# EAGLE design IFB-40002-R02 - I2C_Joystick (EAGLE 9.6.2)
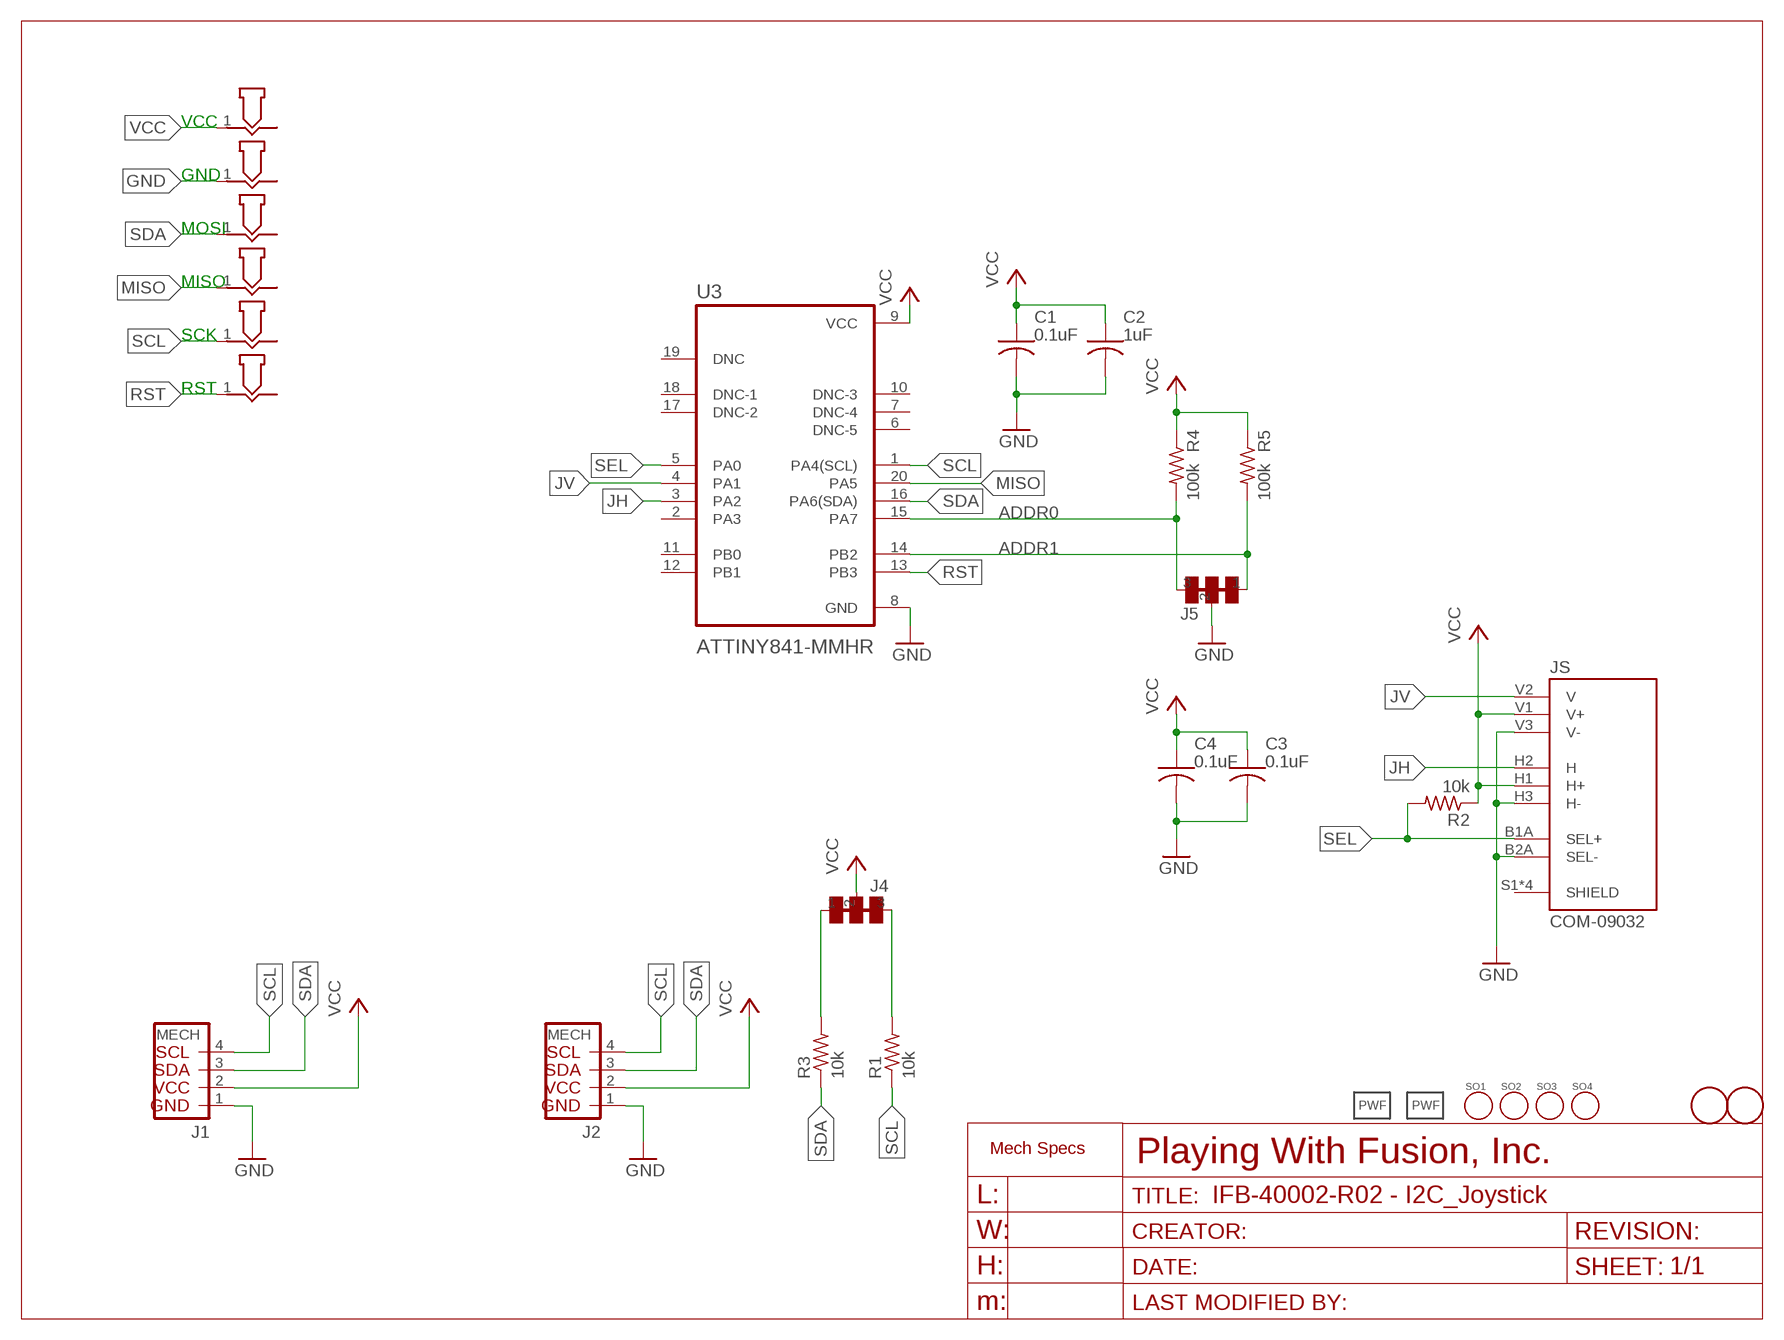
[diagram p0: schematic, sheet 1]

## Parts
C1  0.1uF  C-USC0603K  [C0603K]
C2  1uF  C-USC0603K  [C0603K]
C3  0.1uF  C-USC0603K  [C0603K]
C4  0.1uF  C-USC0603K  [C0603K]
GND  POGO_PAD  [P50_POGO_BOARD_CONTACT_12MIL]
J1  QWIICSIDE  [SM04B-SRSS-TB]
J2  QWIICSIDE  [SM04B-SRSS-TB]
J4  CUT_JUMPER_2X  [SMT_2X_CUTTABLE_JUMPER]
J5  CUT_JUMPER_2X  [SMT_2X_CUTTABLE_JUMPER]
JS  COM-09032  [XDCR_COM-09032]
LOGO1  PWF_LOGOPWF-6MM-SS  [LOGO_6MM_STEIN]
LOGO2  PWF_LOGOPWF-6MM-SS  [LOGO_6MM_STEIN]
MISO  POGO_PAD  [P50_POGO_BOARD_CONTACT_12MIL]
MOSI  POGO_PAD  [P50_POGO_BOARD_CONTACT_12MIL]
R1  10k  R-US_R0603  [R0603]
R2  10k  R-US_R0603  [R0603]
R3  10k  R-US_R0603  [R0603]
R4  100k  R-US_R0603  [R0603]
R5  100k  R-US_R0603  [R0603]
RST  POGO_PAD  [P50_POGO_BOARD_CONTACT_12MIL]
SCK  POGO_PAD  [P50_POGO_BOARD_CONTACT_12MIL]
SO1  STAND_OFFNO4_TIGHT  [STANDOFF_NO4_TIGHT]
SO2  STAND_OFFNO4_TIGHT  [STANDOFF_NO4_TIGHT]
SO3  STAND_OFFNO4_TIGHT  [STANDOFF_NO4_TIGHT]
SO4  STAND_OFFNO4_TIGHT  [STANDOFF_NO4_TIGHT]
U3  ATTINY841-MMHR  [QFN45P300X300X85-21N]
U$2  FIDUCIAL  [FIDUCIAL_1MM]
U$3  FIDUCIAL  [FIDUCIAL_1MM]
VCC  POGO_PAD  [P50_POGO_BOARD_CONTACT_12MIL]

## Nets
ADDR0: J5.3 R4.2 U3.15(PA7)
ADDR1: J5.1 R5.2 U3.14(PB2)
GND: C1.2 C2.2 C3.2 C4.2 GND.1 J1.1 J2.1 J5.2 JS.B2A(SEL-) JS.H3(H-) JS.V3(V-) U3.8(GND)
JH: JS.H2(H) U3.3(PA2)
JV: JS.V2(V) U3.4(PA1)
MISO: MISO.1 U3.20(PA5)
N$2: J4.1 R3.2
N$3: J4.3 R1.2
RST: RST.1 U3.13(PB3)
SCL: J1.4 J2.4 R1.1 SCK.1 U3.1(PA4(SCL))
SDA: J1.3 J2.3 MOSI.1 R3.1 U3.16(PA6(SDA))
SEL: JS.B1A(SEL+) R2.2 U3.5(PA0)
VCC: C1.1 C2.1 C3.1 C4.1 J1.2 J2.2 J4.2 JS.H1(H+) JS.V1(V+) R2.1 R4.1 R5.1 U3.9(VCC) VCC.1
Unconnected: J1.MECH1(MECH) J1.MECH2(MECH) J2.MECH1(MECH) J2.MECH2(MECH) JS.S1(SHIELD) JS.S2(SHIELD) JS.S3(SHIELD) JS.S4(SHIELD) U3.2(PA3) U3.6(DNC-5) U3.7(DNC-4) U3.10(DNC-3) U3.11(PB0) U3.12(PB1) U3.17(DNC-2) U3.18(DNC-1) U3.19(DNC)

## Notes on the sheet
- VCC
- GND
- MOSI
- MISO
- SCK
- RST

## Library data of the parts
C1-C4 = rcl:C-US: CAPACITOR, American symbol; SPICEPREFIX: C
GND MISO MOSI RST SCK VCC = PlayingWithFusion_Breakout-Lib:POGO_PAD
J1 J2 = PlayingWithFusion_JST:QWIIC
J4 J5 = PlayingWithFusion_Breakout-Lib:CUT_JUMPER_2X
JS = COM-09032:COM-09032: Thumb Joystick Check availability <https://pricing.snapeda.com/parts/COM-09032/SparkFun%20Electronics/view-part?ref=eda>; AVAILABILITY: In Stock; DESCRIPTION: Joystick, 2 - Axis Analog (Resistive) Output; MF: SparkFun Electronics; MP: COM-09032; PACKAGE: SparkFun Electronics; PRICE: None; PURCHASE-URL: https://pricing.snapeda.com/search/part/COM-09032/?ref=eda
LOGO1 LOGO2 = PlayingWithFusion_Logo:PWF_LOGO
R1-R5 = rcl:R-US_: RESISTOR, American symbol; SPICEPREFIX: R
SO1-SO4 = PlayingWithFusion_Breakout-Lib:STAND_OFF: Stand Off This is the mechanical footprint for a #4 phillips button head screw. Use the keepout ring to avoid running the screw head into surrounding components. SKU : PRT-00447
U3 = ATTINY841-MMHR:ATTINY841-MMHR: None Check availability <https://pricing.snapeda.com/parts/ATTINY841-MMHR/Microchip/view-part?ref=eda>; AVAILABILITY: In Stock; DESCRIPTION: AVR AVR® ATtiny Microcontroller IC 8-Bit 16MHz 8KB (8K x 8) FLASH 20-VQFN (3x3); MF: Microchip; MP: ATTINY841-MMHR; PACKAGE: DFN-20 Microchip; PRICE: None; PURCHASE-URL: https://pricing.snapeda.com/search/part/ATTINY841-MMHR/?ref=eda
U$2 U$3 = PlayingWithFusion_Breakout-Lib:FIDUCIAL: For use by pick and place machines to calibrate the vision/machine, 1mm By microbuilder.eu

## Board
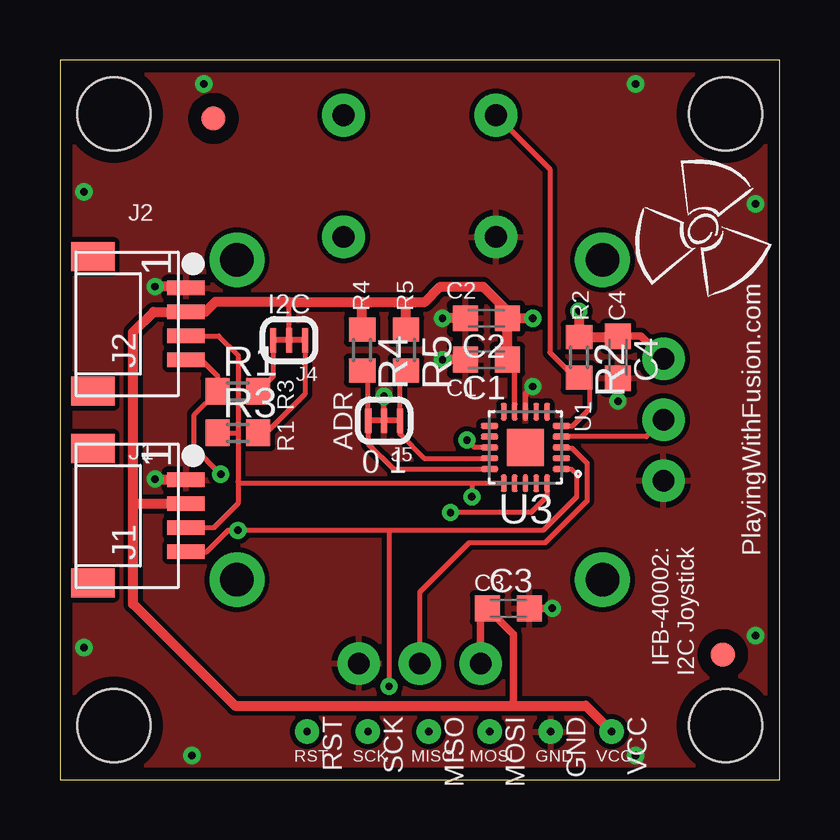
[diagram p1: board, top side]
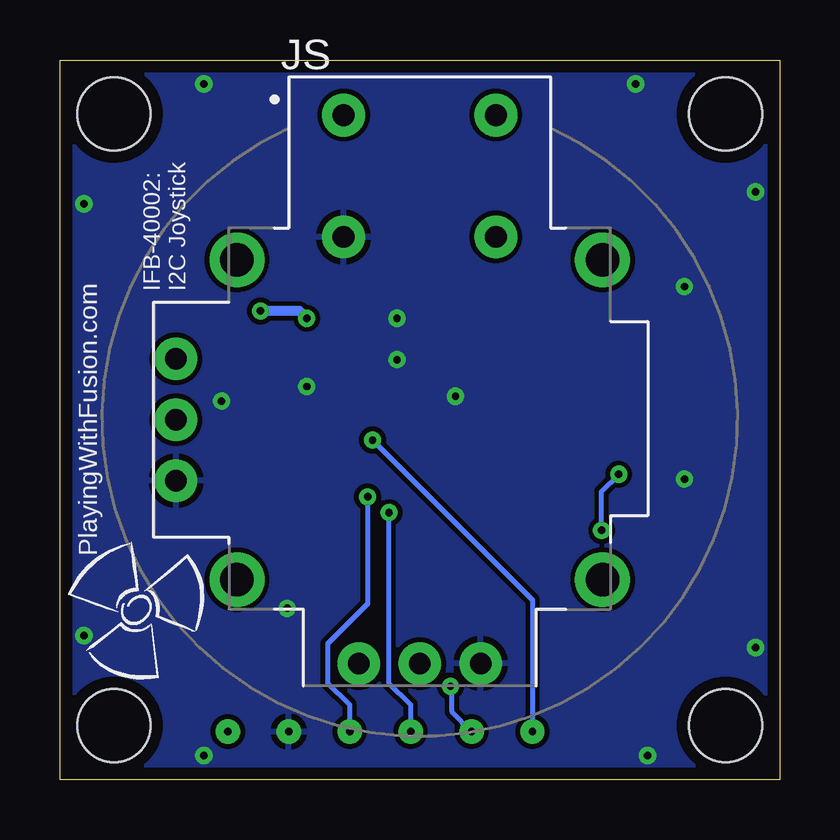
[diagram p2: board, bottom side, seen from below]

Size 30 x 30 mm. Coordinates in mm from the lower left corner, seen from the top.
Outline: 0,30 0,0 30,0 30,30 0,30
Copper layers (1*16): Top 0.035mm / dielectric 1.5mm / Bottom 0.035mm
Design rules "default *": minimum track width 8mil, minimum drill 12mil, track to track 8mil, track to pad 8mil, pad to pad 8mil, via to via 8mil, smd to smd 8mil, copper to edge 20mil, drill to drill 8mil, minimum pad ring 10mil, minimum via ring 8mil, stop-mask expansion 4mil, vias tented up to drill 17mil, thermal gap 10mil

### Footprints (pad centres in the part's own frame; a part is rotated, then mirrored left to right if it is on the bottom)
C0603K = smd 1.05 x 1.08: 1 -0.875,0; 2 0.875,0
P50_POGO_BOARD_CONTACT_12MIL = drill 0.305 pad 1.016: 1 0,0
SM04B-SRSS-TB = smd 0.6 x 1.55: 1 1.5,0; 2 0.5,0; 3 -0.5,0; 4 -1.5,0 | smd 1.2 x 1.8: MECH1 2.8,3.875; MECH2 -2.8,3.875
SMT_2X_CUTTABLE_JUMPER = smd 0.254 x 1.016: 1 -0.66,0; 2 0,0; 3 0.66,0
XDCR_COM-09032 = drill 0.9 pad 1.778: B1A -3.175,12.7; B1B 3.175,12.7; B2A -3.175,7.62; B2B 3.175,7.62 | drill 0.889 pad 1.778: H1 -2.54,-10.16; H2 0,-10.16; H3 2.54,-10.16; V1 -10.16,2.54; V2 -10.16,0; V3 -10.16,-2.54 | drill 1.397 pad 2.286: S1 -7.62,6.668; S2 -7.62,-6.668; S3 7.62,-6.668; S4 7.62,6.668
R0603 = smd 1 x 1.1: 1 -0.85,0; 2 0.85,0
STANDOFF_NO4_TIGHT = hole 3.048: 0,0
QFN45P300X300X85-21N = smd 0.72 x 0.24: 1 -1.495,0.9; 2 -1.495,0.45; 3 -1.495,0; 4 -1.495,-0.45; 5 -1.495,-0.9; 11 1.495,-0.9; 12 1.495,-0.45; 13 1.495,0; 14 1.495,0.45; 15 1.495,0.9 | smd 0.24 x 0.72: 6 -0.9,-1.495; 7 -0.45,-1.495; 8 0,-1.495; 9 0.45,-1.495; 10 0.9,-1.495; 16 0.9,1.495; 17 0.45,1.495; 18 0,1.495; 19 -0.45,1.495; 20 -0.9,1.495 | smd 1.55 x 1.55: 21 0,0
FIDUCIAL_1MM = smd 1 x 1: 1 0,0

### Placement (x,y rotation side)
C1  17.78,17.5 180 top
C2  17.78,19.23 180 top
C3  18.69,7.14 0 top
C4  23.27,17.6 270 top
GND  20.46,2 270 top
J1  5.25,11 90 top
J2  5.25,19 90 top
J4  9.55,18.32 180 top
J5  13.51,14.96 180 top
JS  15,15 0 bottom
LOGO1  26.82,22.99 270 top
LOGO2  26.82,7.04 90 bottom
MISO  15.38,2 270 top
MOSI  17.92,2 270 top
R1  7.42,16.18 0 top
R2  21.64,17.6 270 top
R3  7.42,14.46 0 top
R4  12.6,17.91 270 top
R5  14.43,17.91 270 top
RST  10.3,2 270 top
SCK  12.84,2 270 top
SO1  2.25,2.25 270 top
SO2  27.75,27.75 270 top
SO3  27.75,2.25 270 top
SO4  2.25,27.75 270 top
U3  19.41,13.85 180 top
U$2  27.64,5.21 270 top
U$3  6.4,27.56 270 top
VCC  23,2 270 top

### Tracks (layer width: path | path; a pad name or v marks a point on that pad's centre or on a via)
ADDR0
  Top 0.203: R4.2 12.85,16.81 J5.3 12.85,14 13.9,12.95 U3.15
ADDR1
  Top 0.203: R5.2 14.17,16.81 J5.1 14.17,14.4 15.18,13.4 U3.14
GND  (via drill 0.3)
  Top 0.203: J5.2 v13.51,15.98
  Top 0.229: U3.8 19.41,16.08 v19.71,16.39
  Top 0.305: C3.2 v20.52,7.14 | C4.2 v23.27,15.78
  Top 0.406: C1.2 v15.95,17.5 | C2.2 v15.95,19.23 | J2.1 5.2,20.55 v3.96,20.55 | J1.1 3.99,12.5 v3.96,12.53
  other vias: 1,24.5 1,5.5 5.5,1 24,1 29,6 29,24 24,29 6,29
  pour Bottom: 30,30 0,30 0,0 30,0
  pour Top: 30,30 0,30 0,0 30,0
JH
  Top 0.203: U3.3 20.93,13.82 21.35,13.82 21.97,13.2 21.97,11.61 20.25,9.88 17.07,9.88 15,7.81 JS.H2
JV
  Top 0.203: JS.V2 24.46,14.3 U3.4
MISO  (via drill 0.3)
  Top 0.203: U3.20 20.31,11.8 19.63,11.13 v16.28,11.13
  Bottom 0.203: MISO.1 15.38,3.12 16.3,4.04 16.3,11.11 v16.28,11.13
N$2
  Top 0.203: R3.2 8.59,14.46 10.21,16.08 J4.1
N$3
  Top 0.203: R1.2 8.89,16.81 J4.3
RST  (via drill 0.3)
  Top 0.203: U3.13 17.27,13.85 v16.97,14.15
  Bottom 0.203: v16.97,14.15 10.3,7.48 RST.1
SCL  (via drill 0.3)
  Top 0.203: U3.1 21.31,12.95 21.54,12.71 21.54,11.8 20.14,10.39 13.72,10.39 | 13.72,10.39 v7.42,10.39 7.01,10.39 6.12,9.5 J1.4 | 13.72,10.39 v13.72,3.89 | v6.71,12.73 5.6,13.84 5.6,15.21 R1.1 6.57,16.83 5.9,17.5 J2.4
  Bottom 0.203: v7.42,10.39 7.42,12.02 v6.71,12.73 | SCK.1 13.65,2.81 13.65,3.83 v13.72,3.89
SDA  (via drill 0.3)
  Top 0.203: U3.16 17.17,12.35 | 17.17,12.35 v17.17,11.79 | R3.1 7.42,14.46 | J2.3 6.62,18.5 7.42,17.71 7.42,14.46 | J1.3 6.41,10.5 7.42,11.51 7.42,12.42 | 7.42,14.46 7.42,12.42 | 7.42,12.42 7.49,12.35 17.17,12.35
  Bottom 0.203: MOSI.1 17.92,3.12 18.84,4.04 18.84,5.65 17.17,7.32 v17.17,11.79
SEL
  Top 0.203: U3.5 21.36,14.75 22.08,15.47 22.08,16.31 R2.2 21.48,16.75 20.42,17.81 20.42,25.45 JS.B1A
VCC  (via drill 0.3)
  Top 0.203: J4.2 9.55,19.91
  Top 0.229: 18.96,17.14 18.66,17.44 C1.1 | 18.96,17.54 18.96,17.14 | 18.96,17.14 U3.9
  Top 0.305: JS.H1 17.54,6.86 C3.1 18.9,6.06 18.9,3.18 18.8,3.08 | C4.1 24.22,18.48 JS.V1
  Top 0.406: C2.1 18.66,19.54 17.64,20.55 15.85,20.55 15.21,19.91 14.43,19.91 | C1.1 C2.1 | 3.05,11.41 3.05,7.32 7.29,3.08 18.8,3.08 21.92,3.08 VCC.1 | 3.05,11.41 3.05,18.65 3.9,19.5 J2.2 6.06,19.5 6.48,19.91 9.55,19.91 12.6,19.91 | J1.2 3.14,11.5 3.05,11.41 | 12.6,19.91 14.43,19.91 | R5.1 14.43,19.91 | R4.1 12.6,19.91 | C2.1 v19.71,19.23 | v21.64,19.54 R2.1 23.24,18.45 C4.1
  Bottom 0.406: v19.71,19.23 20.02,19.54 v21.64,19.54

### Text on the board
tPlace: J2 | C2 | R4 | R5 | I2C | R2 | C4 | R3 | C1 | U1 | R1 | ADR | PlayingWithFusion.com | 0 1 | J1 | IFB-40002: / I2C Joystick | C3 | RST | SCK | MISO | MOSI | GND | VCC
bPlace: IFB-40002: / I2C Joystick | PlayingWithFusion.com